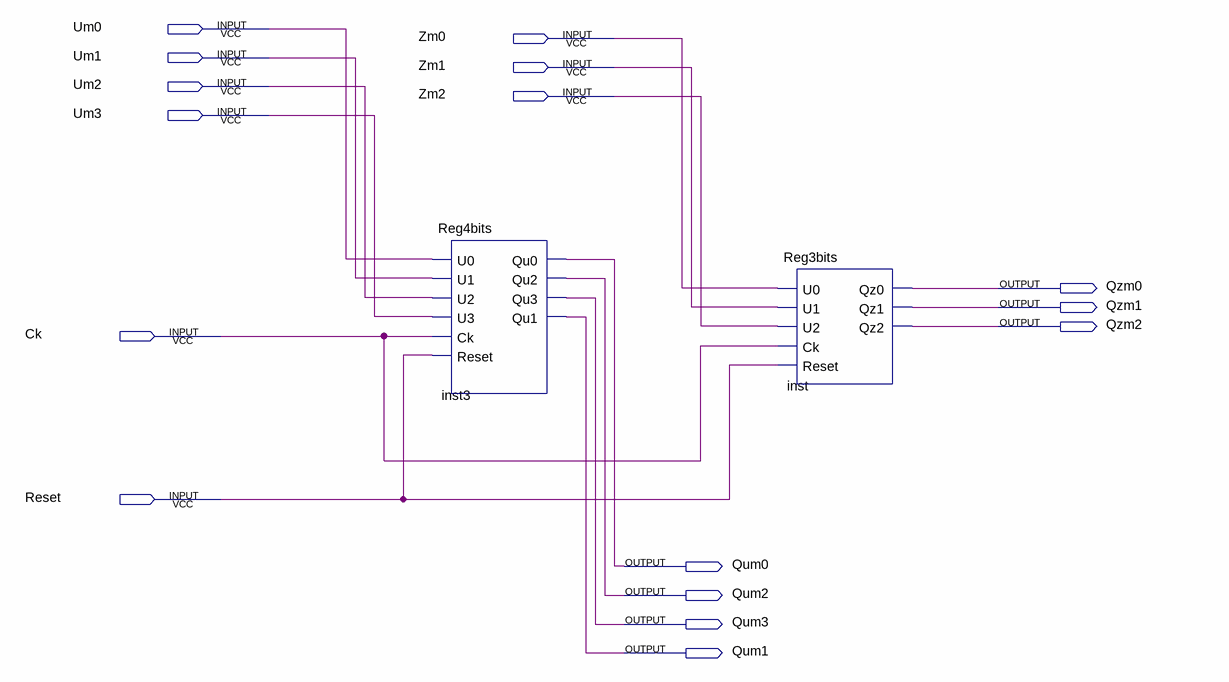
[diagram p0: schematic sheet]
// Quartus schematic RegMin.bdf as structural Verilog: 2 symbols, 16 pins
module RegMin (
  input  Um0,
  input  Zm0,
  input  Um1,
  input  Zm1,
  input  Um2,
  input  Zm2,
  input  Um3,
  input  Ck,
  input  Reset,
  output Qzm0,
  output Qzm1,
  output Qzm2,
  output Qum0,
  output Qum2,
  output Qum3,
  output Qum1
);

  Reg4bits inst3 (
    .U0(Um0), .U1(Um1), .U2(Um2), .U3(Um3), .Ck(Ck), .Reset(Reset), .Qu0(Qum0), .Qu2(Qum2), .Qu3(Qum3),
    .Qu1(Qum1));
  Reg3bits inst (.U0(Zm0), .U1(Zm1), .U2(Zm2), .Ck(Ck), .Reset(Reset), .Qz0(Qzm0), .Qz1(Qzm1), .Qz2(Qzm2));
endmodule
